# EAGLE schematic extio (EAGLE 7.1.0)
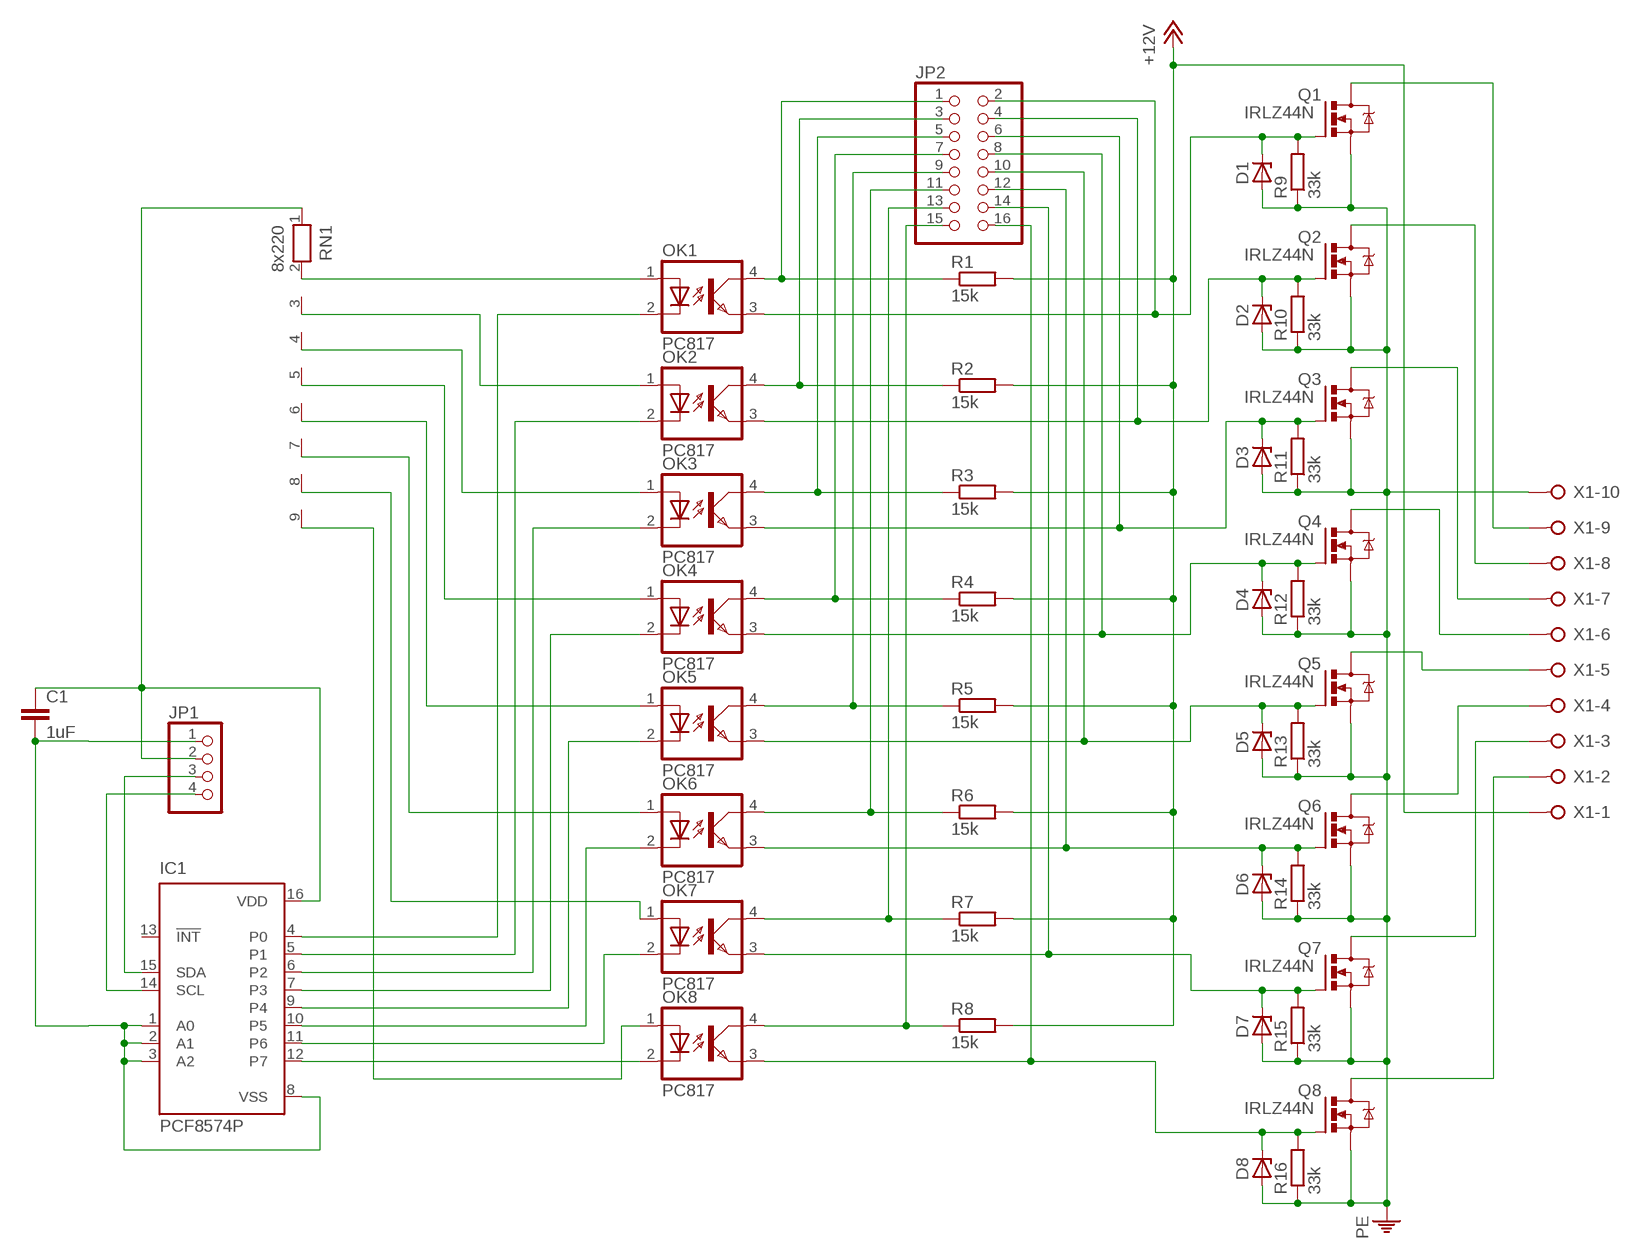
[diagram p0: schematic, sheet 1]

## Parts
C1  1uF  C-EUC0603  [C0603]
D1  ZENER-DIODESOD80C  [SOD80C]
D2  ZENER-DIODESOD80C  [SOD80C]
D3  ZENER-DIODESOD80C  [SOD80C]
D4  ZENER-DIODESOD80C  [SOD80C]
D5  ZENER-DIODESOD80C  [SOD80C]
D6  ZENER-DIODESOD80C  [SOD80C]
D7  ZENER-DIODESOD80C  [SOD80C]
D8  ZENER-DIODESOD80C  [SOD80C]
IC1  PCF8574P  [DIL16]
JP1  PINHD-1X4  [1X04]
JP2  PINHD-2X8  [2X08]
OK1  PC817  [DIL04]
OK2  PC817  [DIL04]
OK3  PC817  [DIL04]
OK4  PC817  [DIL04]
OK5  PC817  [DIL04]
OK6  PC817  [DIL04]
OK7  PC817  [DIL04]
OK8  PC817  [DIL04]
Q1  IRLZ44N  [TO220V]
Q2  IRLZ44N  [TO220V]
Q3  IRLZ44N  [TO220V]
Q4  IRLZ44N  [TO220V]
Q5  IRLZ44N  [TO220V]
Q6  IRLZ44N  [TO220V]
Q7  IRLZ44N  [TO220V]
Q8  IRLZ44N  [TO220V]
R1  15k  R-EU_R0603  [R0603]
R2  15k  R-EU_R0603  [R0603]
R3  15k  R-EU_R0603  [R0603]
R4  15k  R-EU_R0603  [R0603]
R5  15k  R-EU_R0603  [R0603]
R6  15k  R-EU_R0603  [R0603]
R7  15k  R-EU_R0603  [R0603]
R8  15k  R-EU_R0603  [R0603]
R9  33k  R-EU_R0603  [R0603]
R10  33k  R-EU_R0603  [R0603]
R11  33k  R-EU_R0603  [R0603]
R12  33k  R-EU_R0603  [R0603]
R13  33k  R-EU_R0603  [R0603]
R14  33k  R-EU_R0603  [R0603]
R15  33k  R-EU_R0603  [R0603]
R16  33k  R-EU_R0603  [R0603]
RN1  8x220  RN08  [RN-9]
X1  W237-10P  [W237-10P]

## Nets
+12V: R1.2 R2.2 R3.2 R4.2 R5.2 R6.2 R7.2 R8.2 X1.1
N$13: OK1.1(A) RN1.2
N$20: Q1.2(D) X1.9
N$21: JP2.1 OK1.4(COL) R1.1
N$22: JP2.3 OK2.4(COL) R2.1
N$23: JP2.5 OK3.4(COL) R3.1
N$24: JP2.7 OK4.4(COL) R4.1
N$25: JP2.9 OK5.4(COL) R5.1
N$26: JP2.11 OK6.4(COL) R6.1
N$27: JP2.13 OK7.4(COL) R7.1
N$31: IC1.12(P7) OK8.2(C)
N$32: IC1.11(P6) OK7.2(C)
N$34: IC1.10(P5) OK6.2(C)
N$35: IC1.9(P4) OK5.2(C)
N$43: IC1.7(P3) OK4.2(C)
N$44: IC1.6(P2) OK3.2(C)
N$45: IC1.5(P1) OK2.2(C)
N$46: IC1.4(P0) OK1.2(C)
N$47: OK2.1(A) RN1.3
N$48: OK3.1(A) RN1.4
N$49: OK4.1(A) RN1.5
N$50: OK5.1(A) RN1.6
N$51: OK6.1(A) RN1.7
N$52: OK7.1(A) RN1.8
N$53: OK8.1(A) RN1.9
N$54: D1.C JP2.2 OK1.3(EMIT) Q1.1(G) R9.2
N$55: IC1.15(SDA) JP1.3
N$56: JP2.15 OK8.4(COL) R8.1
N$57: D2.C JP2.4 OK2.3(EMIT) Q2.1(G) R10.2
N$60: D3.C JP2.6 OK3.3(EMIT) Q3.1(G) R11.2
N$61: D4.C JP2.8 OK4.3(EMIT) Q4.1(G) R12.2
N$62: D5.C JP2.10 OK5.3(EMIT) Q5.1(G) R13.2
N$63: D6.C JP2.12 OK6.3(EMIT) Q6.1(G) R14.2
N$64: IC1.14(SCL) JP1.4
N$65: D7.C JP2.14 OK7.3(EMIT) Q7.1(G) R15.2
N$66: D8.C JP2.16 OK8.3(EMIT) Q8.1(G) R16.2
N$67: Q2.2(D) X1.8
N$69: C1.1 IC1.16(VDD) JP1.2 RN1.1
N$71: C1.2 IC1.1(A0) IC1.2(A1) IC1.3(A2) IC1.8(VSS) JP1.1
N$72: Q3.2(D) X1.7
N$77: Q4.2(D) X1.6
N$81: Q5.2(D) X1.5
N$85: Q6.2(D) X1.4
N$89: Q7.2(D) X1.3
N$93: Q8.2(D) X1.2
PE: D1.A D2.A D3.A D4.A D5.A D6.A D7.A D8.A Q1.3(S) Q2.3(S) Q3.3(S) Q4.3(S) Q5.3(S) Q6.3(S) Q7.3(S) Q8.3(S) R9.1 R10.1 R11.1 R12.1 R13.1 R14.1 R15.1 R16.1 X1.10
Unconnected: IC1.13(!INT)

## Library data of the parts
C1 = resistor:C-EU: CAPACITOR, European symbol; SPICEPREFIX: C
D1-D8 = gate433:ZENER-DIODE: Z-Diode
IC1 = gate433:PCF8574: I2C-Bus Remote 8-bit I/O expander http://www.semiconductors.philips.com/acrobat_download/datasheets/PCF8574_4.pdf; MPN: PCF8574PN; OC_FARNELL: 204020; OC_NEWARK: 11N8515
JP1 = gate433:PINHD-1X4: PIN HEADER
JP2 = gate433:PINHD-2X8: PIN HEADER
OK1-OK8 = gate433:PC817: SHARP OPTO COUPLER; MPN: PC817X4J000F; OC_FARNELL: 9707727; OC_NEWARK: 97K7059
Q1-Q8 = gate433:IRLZ44N: N-Channel HEXFET® Power MOSFET Logic Level AUTOMOTIVE MOSFET Source: http://www.irf.com/product-info/datasheets/data/irlz44n.pdf
R1-R16 = resistor:R-EU_: RESISTOR, European symbol; SPICEPREFIX: R
RN1 = gate433:RN08: RESISTOR NETWORK; OC_FARNELL: unknown; OC_NEWARK: unknown
X1 = gate433:W237-10P: WAGO SREW CLAMP; OC_FARNELL: unknown; OC_NEWARK: unknown